# EAGLE design arduino_shield_out (EAGLE 7.4.0)
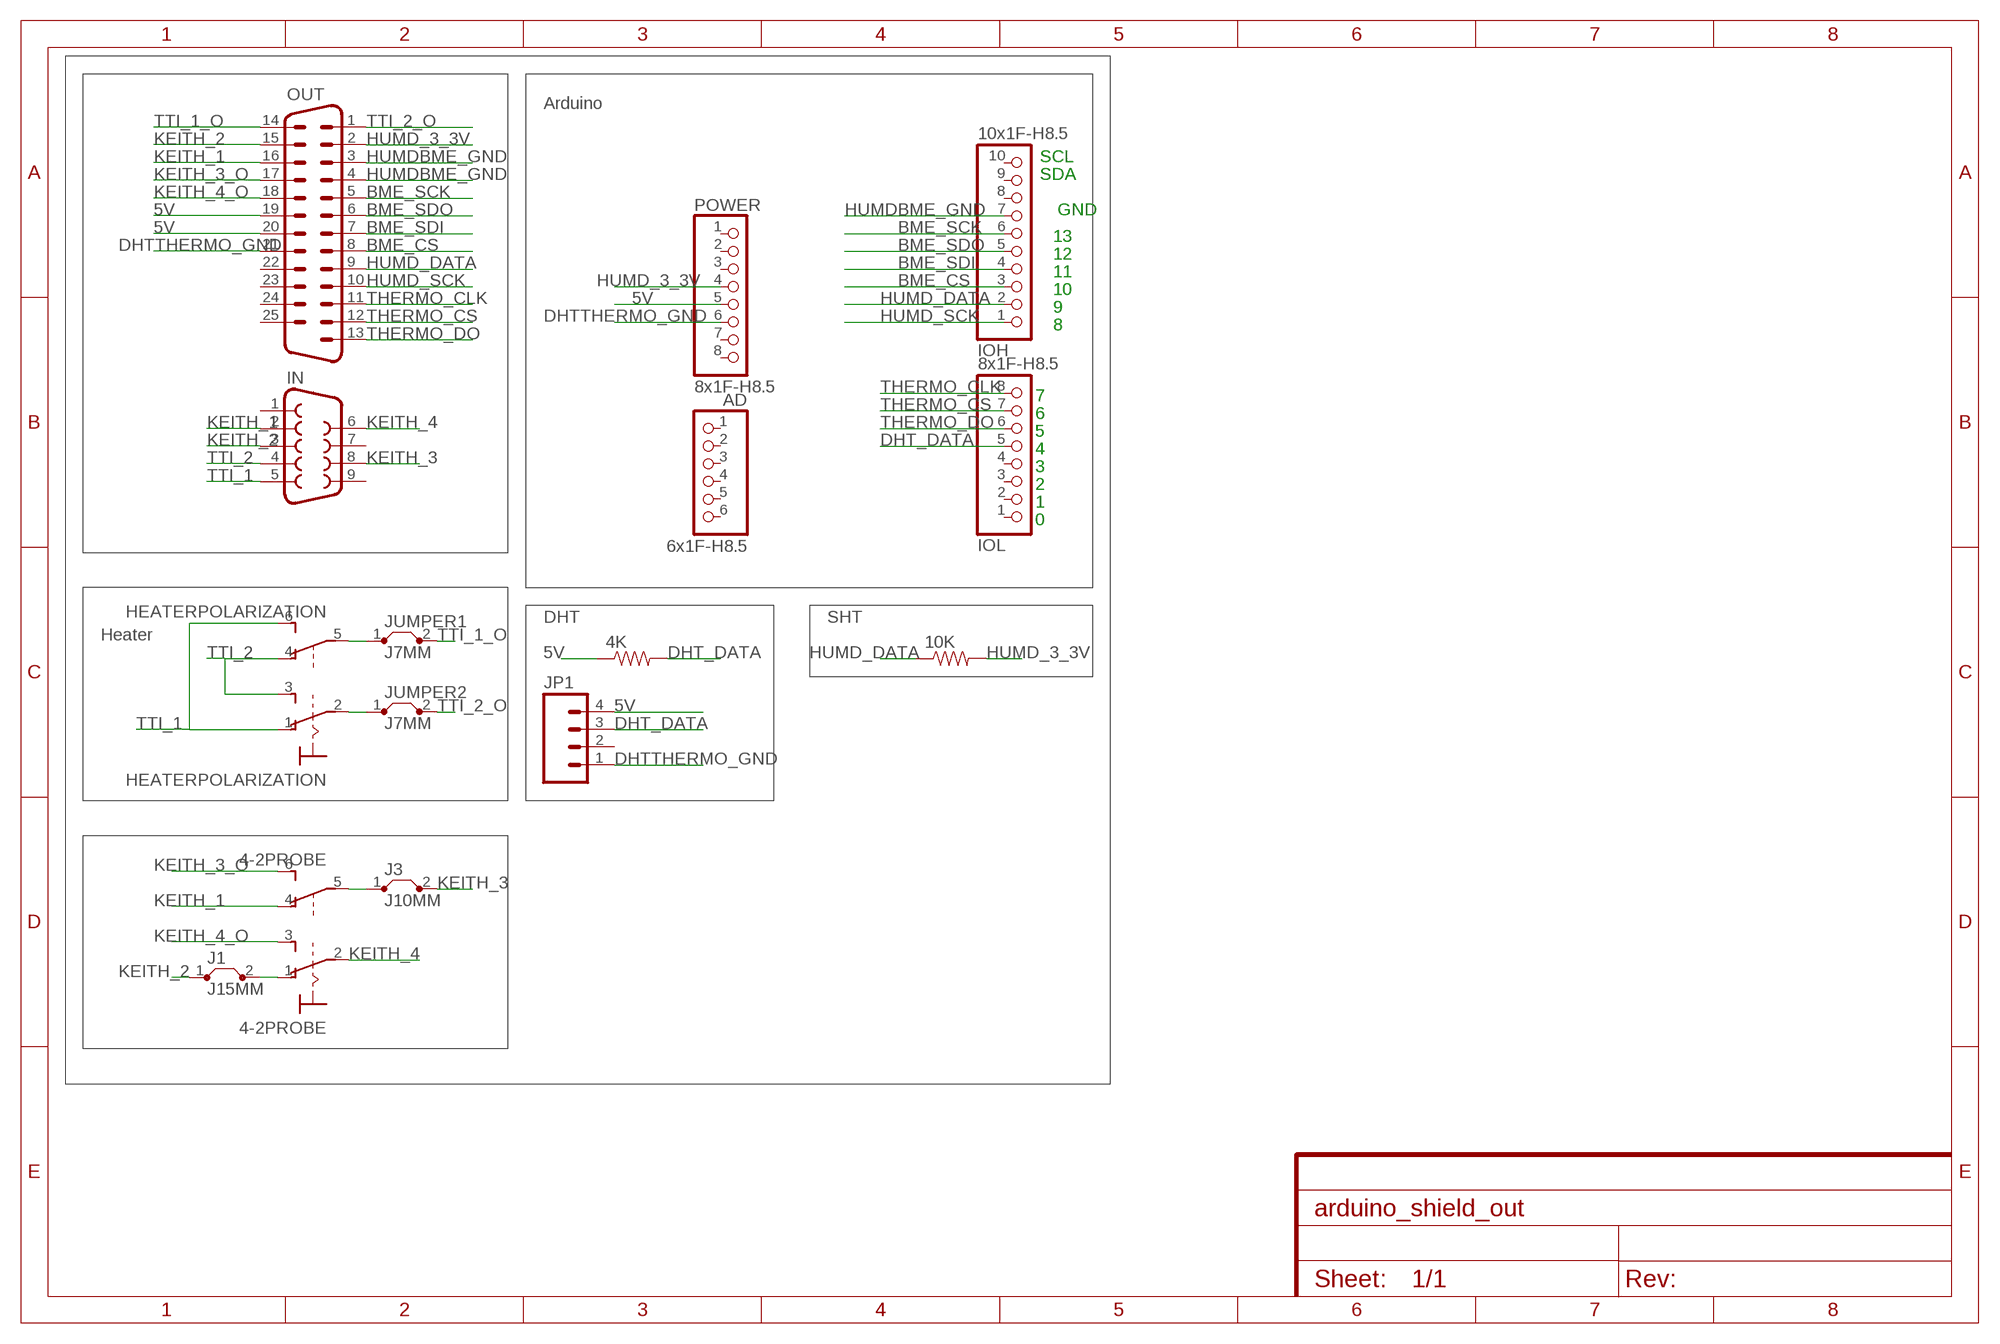
[diagram p0: schematic, sheet 1]

## Parts
4-2PROBE  M9040P2  [M9040P2]
4K  RESISTORPTH-1/2W  [AXIAL-0.5]
10K  RESISTORKIT  [AXIAL-0.3-KIT]
AD  6x1F-H8.5  PINHD-1X6  [1X06]
HEATERPOLARIZATION  M9040P2  [M9040P2]
IN  DB9FEMALE  [DB9]
IOH  10x1F-H8.5  PINHD-1X10_ARD  [1X10]
IOL  8x1F-H8.5  PINHD-1X8  [1X08]
J1  J15MM  [15]
J3  J10MM  [10]
JP1  M04PTH  [1X04]
JUMPER1  J7MM  [07]
JUMPER2  J7MM  [07]
OUT  DB25V  [M25V]
POWER  8x1F-H8.5  PINHD-1X8  [1X08]

## Nets
5V: 4K.P$1 JP1.4 OUT.19 OUT.20 POWER.5
BME_CS: IOH.3 OUT.8
BME_SCK: IOH.6 OUT.5
BME_SDI: IOH.4 OUT.7
BME_SDO: IOH.5 OUT.6
DHT_DATA: 4K.P$2 IOL.5 JP1.3
DHTTHERMO_GND: JP1.1 OUT.21 POWER.6
HUMD_3_3V: 10K.P$2 OUT.2 POWER.4
HUMD_DATA: 10K.P$1 IOH.2 OUT.9
HUMD_SCK: IOH.1 OUT.10
HUMDBME_GND: IOH.7 OUT.3 OUT.4
KEITH_1: 4-2PROBE.4(2:O) IN.2 OUT.16
KEITH_2: IN.3 J1.1 OUT.15
KEITH_3: IN.8 J3.2
KEITH_3_O: 4-2PROBE.6(2:S) OUT.17
KEITH_4: 4-2PROBE.2(1:P) IN.6
KEITH_4_O: 4-2PROBE.3(1:S) OUT.18
N$1: HEATERPOLARIZATION.5(2:P) JUMPER1.1
N$2: HEATERPOLARIZATION.2(1:P) JUMPER2.1
N$14: 4-2PROBE.1(1:O) J1.2
N$15: 4-2PROBE.5(2:P) J3.1
THERMO_CLK: IOL.8 OUT.11
THERMO_CS: IOL.7 OUT.12
THERMO_DO: IOL.6 OUT.13
TTI_1: HEATERPOLARIZATION.1(1:O) HEATERPOLARIZATION.6(2:S) IN.5
TTI_1_O: JUMPER1.2 OUT.14
TTI_2: HEATERPOLARIZATION.3(1:S) HEATERPOLARIZATION.4(2:O) IN.4
TTI_2_O: JUMPER2.2 OUT.1
Unconnected: AD.1 AD.2 AD.3 AD.4 AD.5 AD.6 IN.1 IN.7 IN.9 IOH.8 IOH.9 IOH.10 IOL.1 IOL.2 IOL.3 IOL.4 JP1.2 OUT.22 OUT.23 OUT.24 OUT.25 POWER.1 POWER.2 POWER.3 POWER.7 POWER.8

## Notes on the sheet
- Arduino
- SCL
- SDA
- GND
- 13
- 12
- 11
- 10
- 9
- 8
- 7
- 6
- 5
- 4
- 3
- 2
- 1
- 0
- DHT | SHT
- Heater

## Library data of the parts
4-2PROBE HEATERPOLARIZATION = switch:M9040P2: TOGGLE SWITCH Marquardt
4K 10K = SparkFun-Resistors:RESISTOR: Resistor Basic schematic elements and footprints for 0603, 1206, and PTH resistors.
AD = SmartPrj:PINHD-1X6: PIN HEADER
IN = SparkFun-Connectors:DB9: DB9 Connector Standard DB9 (D-Sub 9) serial connector. Can be used for CAN bus as well as RS485 and RS232. Footprint production proven. Spark Fun Electronics SKU : PRT-00429
IOH = SmartPrj:PINHD-1X10_ARD: PIN HEADER
IOL POWER = SmartPrj:PINHD-1X8: PIN HEADER
J1 J3 JUMPER1 JUMPER2 = jumper:J: Bridge
JP1 = SparkFun-Connectors:M04: Header 4 Standard 4-pin 0.1" header. Use with straight break away headers (SKU : PRT-00116), right angle break away headers (PRT-00553), swiss pins (PRT-00743), machine pins (PRT-00117), and female headers (PRT-00115). Molex polarized connector foot print use with SKU : PRT-08231 with associated crimp pins and housings. 1MM SMD Version SKU: PRT-10208
OUT = SparkFun-Connectors:DB25: Various DB25 connectors

## Net classes
0 default: width 0.254 mm, clearance 0.254 mm
1 power: width 0.61 mm, drill 0.61 mm, clearance 0.254 mm
2 gnd: width 0.305 mm, drill 0.559 mm, clearance 0.254 mm
3 usbvcc: width 0.508 mm, drill 0.61 mm, clearance 0.254 mm
4 aref: width 0.406 mm, drill 0.61 mm, clearance 0.254 mm

## Board
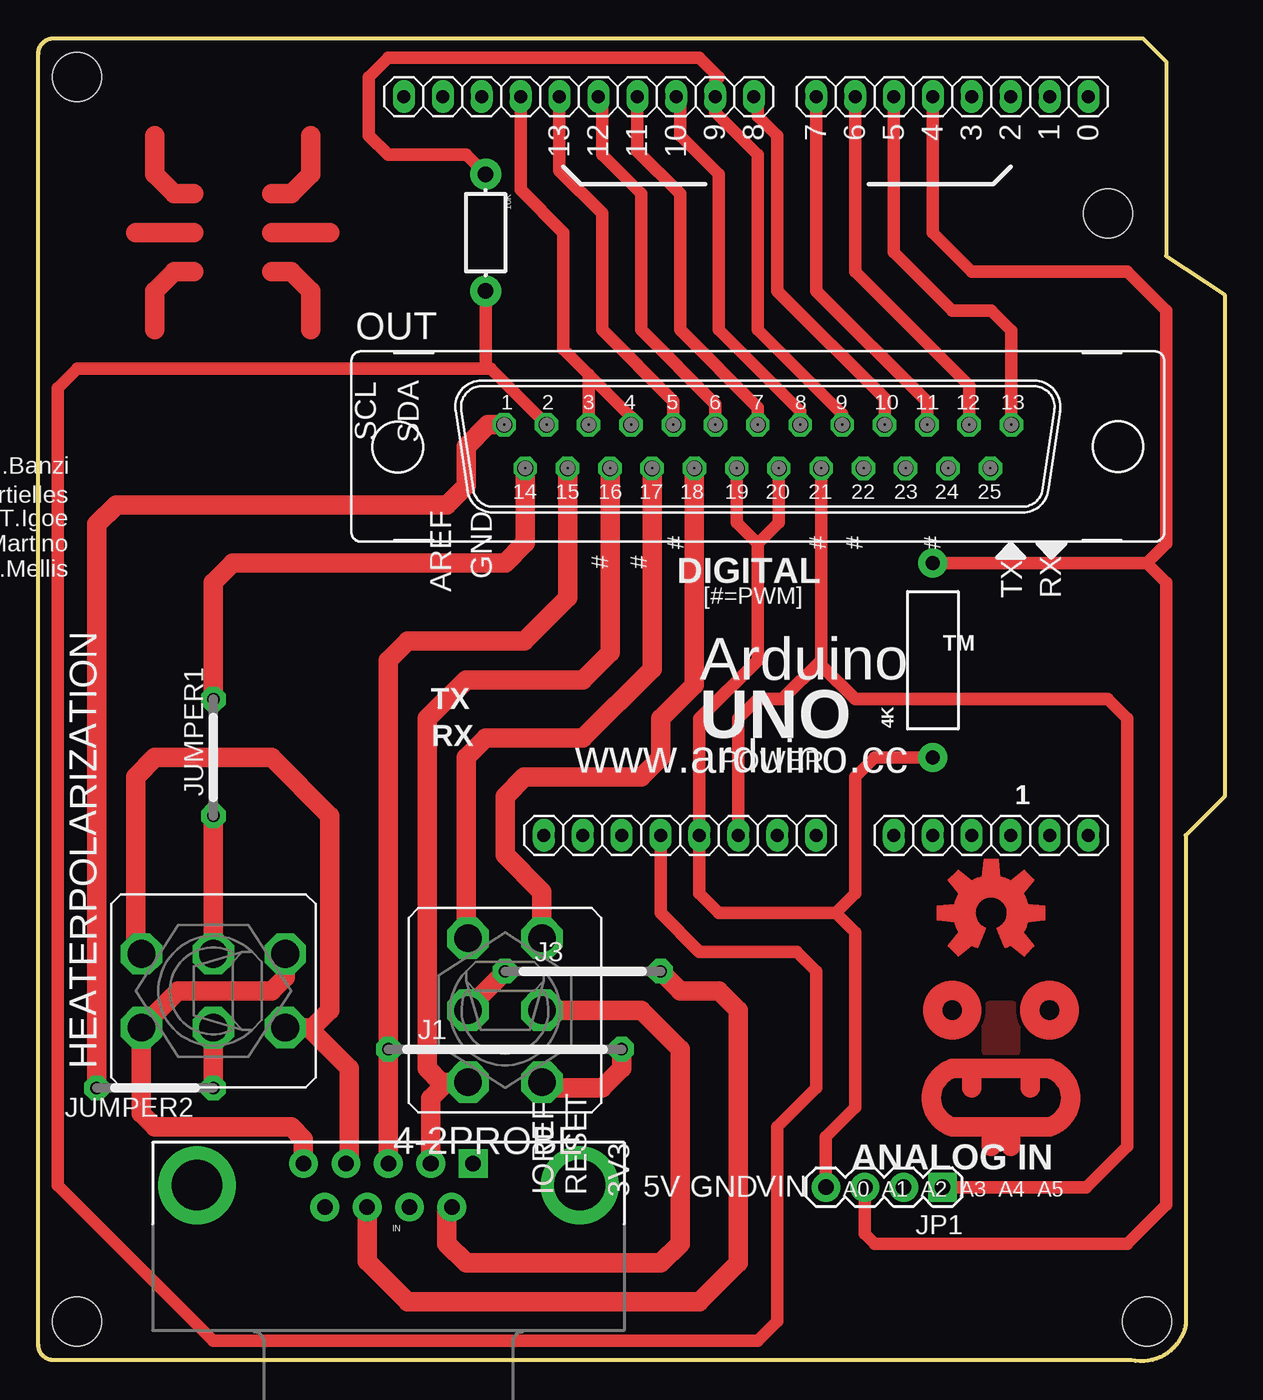
[diagram p1: board, top side]

Size 77.47 x 86.43 mm. Coordinates in mm from the lower left corner, seen from the top.
Outline: 72.14,86.43 73.66,84.9 73.66,72.2 77.47,69.66 77.47,36.9 74.93,34.36 74.93,2.34 arc-90 71.39,0.07 1,0.07 arc-90 0,1.07 0,85.43 arc-90 1,86.43 72.14,86.43
Copper layers (1*16): Top 0.035mm / dielectric 1.5mm / Bottom 0.035mm
Design rules "default": minimum track width 10mil, minimum drill 22mil, track to track 10mil, track to pad 10mil, pad to pad 10mil, via to via 12mil, smd to smd 8mil, copper to edge 26mil, drill to drill 12mil, minimum pad ring 10mil, minimum via ring 10mil, stop-mask expansion 1mil, vias tented up to drill 30mil, thermal gap 10mil
Holes 3.2 mm at 69.85,75 72.39,2.61 2.54,83.89 2.54,2.61
vRestrict: area 25.4,50.5 to 27.2,55.6; area 27.9,51.9 to 29.6,55.6; area 31,51.8 to 32.1,55.2; area 33.5,51.8 to 34.7,55.2; area 36.1,51.8 to 37.2,55.2; area 38.6,51.8 to 39.8,55.2; area 41.3,53.7 to 42.4,55.2; area 42.8,51.5 to 50.2,53.3; area 62.9,50.6 to 64.3,53.2; area 65.4,50.6 to 66.8,53.2; area 63.9,42.2 to 67.3,43.6; area 3.2,28.3 to 4.6,36.5; area 8.3,29 to 9.9,36.5; area 50.4,16.7 to 51.1,17.2; area 53,16.6 to 53.5,17.5; area 13.8,35.2 to 15.2,37.5; area 47.4,53.9 to 48.6,55.3; area 50.2,53.8 to 51.3,55.3; area 52.7,53.8 to 53.8,55.3; area 55.4,53.8 to 56.5,55.3; area 57.8,53.8 to 58.9,55.3; area 60.5,53.8 to 61.6,55.3; area 63,53.8 to 64.1,55.3; area 65.5,53.8 to 66.7,55.3; area 43.8,53.7 to 45,55.2; area 2.8,18.9 to 11.9,30.9

### Footprints (pad centres in the part's own frame; a part is rotated, then mirrored left to right if it is on the bottom)
M9040P2 = drill 1.803 octagon: 1 -2.413,4.699; 2 -2.413,0; 3 -2.413,-4.699; 4 2.413,4.699; 5 2.413,0; 6 2.413,-4.699
AXIAL-0.5 = drill 0.9 pad 1.88: P$1 -6.35,0; P$2 6.35,0
AXIAL-0.3-KIT = drill 1.016 pad 2.032: P$1 -3.81,0; P$2 3.81,0
1X06 = drill 0.85 pad 1.422 long: 1 -6.35,0; 2 -3.81,0; 3 -1.27,0; 4 1.27,0; 5 3.81,0; 6 6.35,0
DB9 = drill 1.016 pad 1.88 square: 1 -5.54,-1.42 | drill 1.016 pad 1.88: 2 -2.77,-1.42; 3 0,-1.42; 4 2.77,-1.42; 5 5.54,-1.42; 6 -4.15,1.42; 7 -1.38,1.42; 8 1.38,1.42; 9 4.15,1.42 | drill 3.302 pad 5.08: G1 -12.5,0; G2 12.5,0
1X10 = drill 0.85 pad 1.422 long: 1 -11.43,0; 2 -8.89,0; 3 -6.35,0; 4 -3.81,0; 5 -1.27,0; 6 1.27,0; 7 3.81,0; 8 6.35,0; 9 8.89,0; 10 11.43,0
1X08 = drill 0.85 pad 1.422 long: 1 -8.89,0; 2 -6.35,0; 3 -3.81,0; 4 -1.27,0; 5 1.27,0; 6 3.81,0; 7 6.35,0; 8 8.89,0
15 = drill 0.813 pad 1.6 octagon: 1 -7.62,0; 2 7.62,0
10 = drill 0.813 pad 1.6 octagon: 1 -5.08,0; 2 5.08,0
1X04 = drill 1.016 pad 1.88 square: 1 0,0 | drill 1.016 pad 1.88: 2 2.54,0; 3 5.08,0; 4 7.62,0
07 = drill 0.813 pad 1.6 octagon: 1 -3.81,0; 2 3.81,0
M25V = drill 1.016 octagon: 1 -16.561,1.422; 2 -13.792,1.422; 3 -11.049,1.422; 4 -8.28,1.422; 5 -5.512,1.422; 6 -2.769,1.422; 7 0,1.422; 8 2.769,1.422; 9 5.512,1.422; 10 8.28,1.422; 11 11.049,1.422; 12 13.792,1.422; 13 16.561,1.422; 14 -15.189,-1.422; 15 -12.421,-1.422; 16 -9.652,-1.422; 17 -6.909,-1.422; 18 -4.14,-1.422; 19 -1.372,-1.422; 20 1.372,-1.422; 21 4.14,-1.422; 22 6.909,-1.422; 23 9.652,-1.422; 24 12.421,-1.422; 25 15.189,-1.422 | hole 3.302: 23.52,0; -23.52,0

### Placement (x,y rotation side)
4-2PROBE  30.48,22.93 180 top
4K  58.42,45.79 90 top
10K  29.21,73.73 270 top
AD  62.23,34.36 0 top
HEATERPOLARIZATION  11.43,24.2 90 top
IN  22.86,11.5 180 top
IOH  35.31,82.62 180 top
IOL  59.69,82.62 180 top
J1  30.48,20.39 0 top
J3  35.56,25.47 0 top
JP1  59.05,11.37 180 top
JUMPER1  11.43,39.44 90 top
JUMPER2  7.62,17.85 180 top
OUT  46.99,59.76 0 top
POWER  41.91,34.36 0 top
U$1  [OSHW-LOGO-L]  62.23,29.28 0 top

### Tracks (layer width: path | path; a pad name or v marks a point on that pad's centre or on a via)
5V
  Top 0.813: 4K.P$1 54.61,39.44 53.34,38.17 53.34,30.55 52.07,29.28 | 46.99,53.41 45.62,54.78 OUT.19 | 46.99,53.41 46.99,45.79 43.18,41.98 POWER.5 43.18,30.55 44.45,29.28 52.07,29.28 | OUT.20 48.36,54.78 46.99,53.41 | 52.07,29.28 53.34,28.01 53.34,16.58 51.44,14.67 JP1.4
BME_CS
  Top 0.813: IOH.3 41.91,82.36 41.91,80.08 44.45,77.54 44.45,67.38 49.76,62.07 OUT.8
BME_SCK
  Top 0.813: IOH.6 34.04,77.79 36.83,75 36.83,67.38 41.48,62.73 OUT.5
BME_SDI
  Top 0.813: IOH.4 39.12,79.06 41.91,76.27 41.91,67.38 46.99,62.3 OUT.7
BME_SDO
  Top 0.813: IOH.5 36.83,82.36 36.83,78.81 39.37,76.27 39.37,67.38 44.22,62.53 OUT.6
DHT_DATA
  Top 0.813: JP1.3 53.98,8.32 54.61,7.69 71.12,7.69 73.66,10.23 73.66,50.87 72.39,52.14 | 4K.P$2 72.39,52.14 | 72.39,52.14 73.66,53.41 73.66,68.65 71.12,71.19 60.96,71.19 58.42,73.73 IOL.5
DHTTHERMO_GND
  Top 0.813: JP1.1 68.45,11.37 71.12,14.04 71.12,41.98 69.85,43.25 53.34,43.25 51.13,45.46 51.13,45.79 | POWER.6 45.72,41.98 46.99,43.25 48.59,43.25 51.13,45.79 | OUT.21 51.13,45.79
HUMD_3_3V
  Top 0.813: POWER.4 40.64,29.28 43.18,26.74 49.53,26.74 50.8,25.47 50.8,17.85 48.26,15.31 48.26,2.61 46.99,1.34 11.43,1.34 1.27,11.5 1.27,63.57 2.54,64.84 29.21,64.84 | 10K.P$2 29.21,64.84 | 29.21,64.84 29.54,64.84 OUT.2
HUMD_DATA
  Top 0.813: IOH.2 44.2,81.6 46.99,78.81 46.99,67.38 52.5,61.87 OUT.9 | 44.45,82.62 IOH.2 | 10K.P$1 27.94,78.81 22.86,78.81 21.59,80.08 21.59,83.89 22.86,85.16 43.18,85.16 44.45,83.89 44.2,83.63 IOH.2
HUMD_SCK
  Top 0.813: IOH.1 46.99,82.36 46.99,81.35 48.26,80.08 48.26,69.92 55.27,62.91 OUT.10
HUMDBME_GND
  Top 0.813: IOH.7 31.5,76.52 34.29,73.73 34.29,66.11 35.94,64.46 | 35.94,64.46 OUT.3 | OUT.4 38.71,61.69 35.94,64.46
KEITH_1
  Top 1.27: 4-2PROBE.4 26.67,18.23 | 26.67,18.23 26.29,18.23 25.4,19.12 25.4,41.98 27.94,44.52 35.56,44.52 37.34,46.3 OUT.16 | IN.2 25.63,17.19 26.67,18.23
KEITH_2
  Top 1.27: J1.1 IN.3 22.86,45.79 24.13,47.06 31.75,47.06 34.57,49.88 OUT.15
KEITH_3
  Top 1.27: IN.8 21.48,6.53 24.13,3.88 43.18,3.88 45.72,6.42 45.72,22.93 44.45,24.2 41.91,24.2 J3.2
KEITH_3_O
  Top 1.27: 4-2PROBE.6 27.94,27.75 27.94,39.44 29.21,40.71 35.56,40.71 40.08,45.23 OUT.17
KEITH_4
  Top 1.27: 4-2PROBE.2 39.37,22.93 41.91,20.39 41.91,7.69 40.64,6.42 27.94,6.42 26.67,7.69 26.67,9.74 IN.6
KEITH_4_O
  Top 1.27: 4-2PROBE.3 32.89,30.67 30.48,33.09 30.48,36.9 31.75,38.17 39.37,38.17 40.64,39.44 40.64,41.98 42.85,44.19 OUT.18
N$1
  Top 1.27: JUMPER1.1 HEATERPOLARIZATION.5
N$2
  Top 1.27: HEATERPOLARIZATION.2 JUMPER2.1
N$3
  Top 1.27: 66.04,15.31 arc143 66.04,19.12 59.69,19.12 arc143 59.69,15.31
N$4
  Top 1.27: 59.69,19.12 60.96,19.12 | 60.96,19.12 64.77,19.12 | 64.77,19.12 66.04,19.12 | 60.96,19.12 60.96,17.85 | 64.77,19.12 64.77,17.85
N$5
  Top 1.27: 66.04,15.31 63.5,15.31 | 63.5,15.31 62.23,15.31 | 62.23,15.31 59.69,15.31 | 62.23,15.31 62.23,14.04 | 63.5,15.31 63.5,14.04
N$6
  pour Top: 62.23,22.93 62.23,20.39 63.5,20.39 63.5,22.93
N$8
  Top 1.27: 10.16,71.19 8.89,71.19 7.62,69.92 7.62,67.38
N$9
  Top 1.27: 7.62,80.08 7.62,77.54 8.89,76.27 10.16,76.27
N$10
  Top 1.27: 17.78,80.08 17.78,77.54 16.51,76.27 15.24,76.27
N$11
  Top 1.27: 15.24,73.73 19.05,73.73
N$12
  Top 1.27: 15.24,71.19 16.51,71.19 17.78,69.92 17.78,67.38
N$13
  Top 1.27: 10.16,73.73 6.35,73.73
N$14
  Top 1.27: J1.2 38.1,19.12 36.83,17.85 33.27,17.85 4-2PROBE.1
N$15
  Top 1.27: 4-2PROBE.5 28.07,23.05 J3.1
THERMO_CLK
  Top 0.813: IOL.8 50.8,69.92 58.04,62.68 OUT.11
THERMO_CS
  Top 0.813: IOL.7 53.34,71.19 60.78,63.75 OUT.12
THERMO_DO
  Top 0.813: IOL.6 55.88,72.46 59.69,68.65 62.23,68.65 63.55,67.33 OUT.13
TTI_1
  Top 1.27: IN.5 17.32,14.5 16.51,15.31 7.62,15.31 6.73,16.2 HEATERPOLARIZATION.1 9.14,24.2 15.24,24.2 16.13,25.09 HEATERPOLARIZATION.6
TTI_1_O
  Top 1.27: JUMPER1.2 11.43,50.87 12.7,52.14 30.48,52.14 31.75,53.41 31.8,53.46 OUT.14
TTI_2
  Top 1.27: HEATERPOLARIZATION.4 6.35,26.99 6.35,38.17 7.62,39.44 15.24,39.44 19.05,35.63 19.05,22.93 17.91,21.78 17.78,21.78 | 17.78,21.78 HEATERPOLARIZATION.3 | 17.78,21.78 17.78,21.66 20.32,19.12 20.32,13.15 IN.4
TTI_2_O
  Top 1.27: JUMPER2.2 3.81,54.68 5.08,55.95 26.67,55.95 27.94,57.22 27.94,59.76 29.36,61.18 OUT.1
(copper drawn outside any net)
  shapes: Top circle x2

### Text on the board
tPlace: 13 | 12 | 11 | 10 | 9 | 8 | 7 | 6 | 5 | 4 | 3 | 2 | 1 | 0
tNames: SCL | SDA | M.Banzi | D.Cuartielles | T.Igoe | AREF | GND | G.Martino | # | # | # | # | D.Mellis | # | # | DIGITAL | [#=PWM] | TX | RX | TM | TX | Arduino | RX | UNO | www.arduino.cc | 1 | ANALOG IN | IOREF | RESET | 3V3 | 5V | GND | VIN | A0 | A1 | A2 | A3 | A4 | A5
bNames: MADE IN | designed by | MADE IN | ITALY | tinker it | ITALY | designed by | tinker it | ATMEGA328
ReferenceLC: L | TX | ON | RX | PC1 | PC2
214bmp: D:/SmartProjects/Snc/a4_bn_logo2.bmp